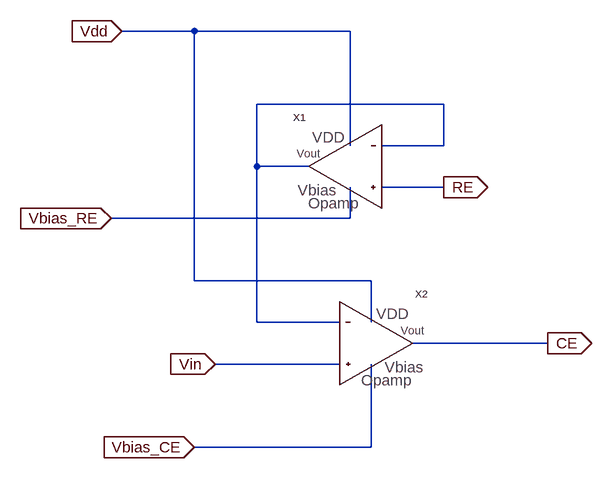
[diagram p0: schematic 1umcontrol.asc]
1umcontrol.asc, the LTspice schematic file:
Version 4
SHEET 1 880 680
WIRE 32 -336 -80 -336
WIRE 272 -336 32 -336
WIRE 416 -224 128 -224
WIRE 272 -160 272 -336
WIRE 416 -160 416 -224
WIRE 416 -160 320 -160
WIRE 128 -128 128 -224
WIRE 208 -128 128 -128
WIRE 416 -96 320 -96
WIRE 272 -48 272 -96
WIRE 272 -48 -96 -48
WIRE 32 48 32 -336
WIRE 304 48 32 48
WIRE 128 112 128 -128
WIRE 256 112 128 112
WIRE 304 112 304 48
WIRE 576 144 368 144
WIRE 256 176 64 176
WIRE 304 304 304 176
WIRE 304 304 32 304
FLAG 64 176 Vin
IOPIN 64 176 In
FLAG -80 -336 Vdd
IOPIN -80 -336 In
FLAG -96 -48 Vbias_RE
IOPIN -96 -48 In
FLAG 32 304 Vbias_CE
IOPIN 32 304 In
FLAG 416 -96 RE
IOPIN 416 -96 Out
FLAG 576 144 CE
IOPIN 576 144 Out
SYMBOL Opamp3ureiauto 240 -128 M0
SYMATTR InstName X1
SYMBOL Opamp3ureiauto 336 144 R0
SYMATTR InstName X2

The netlist it stands for:
* 1umcontrol.asc
XX1 N001 RE N001 Vdd Vbias_RE Opamp3ureiauto  ; pins Vinm Vinp Vout VDD Vbias
XX2 N001 Vin CE Vdd Vbias_CE Opamp3ureiauto  ; pins Vinm Vinp Vout VDD Vbias
.backanno
.end